# Altium schematic sheet USB-Port.SchDoc: External USB Port
size A4; Revision: 1.0
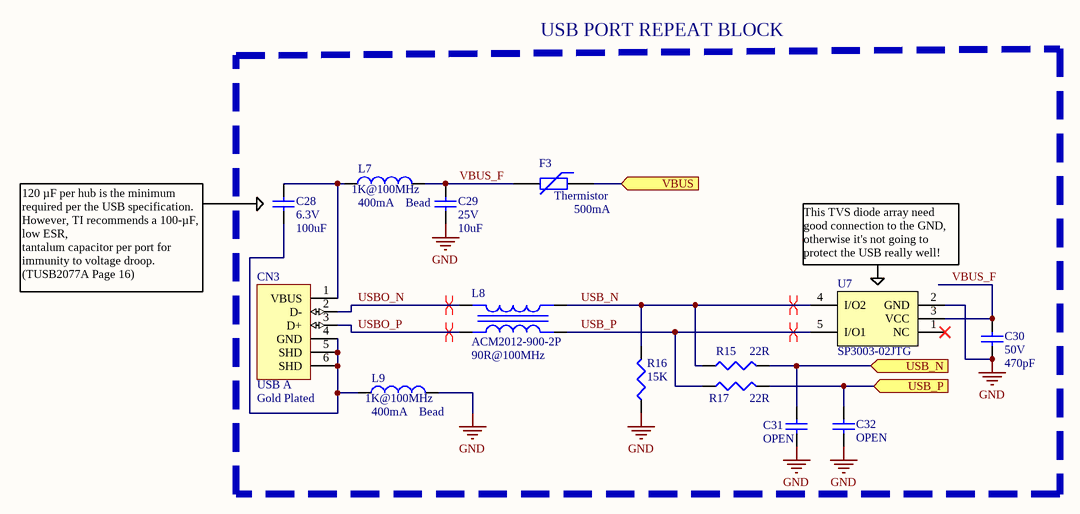
[diagram p0: USB-Port.SchDoc]

## Parts
C28  value 100uF  Tensão: 6.3V  [CC1206]  (hidden comment: Capacitor Cerâmico)
C29  value 10uF  Tensão: 25V  [CC0805]  (hidden comment: Capacitor Cerâmico)
C30  value 470pF  Tensão: 50V  [CC0603]  (hidden comment: Capacitor Cerâmico)
C31  value OPEN  [CC0603]  (hidden comment: Capacitor Cerâmico)  (no BOM)
C32  value OPEN  [CC0603]  (hidden comment: Capacitor Cerâmico)  (no BOM)
CN3  USB A  value Gold Plated  [CONN_USB-A_RCPT-V - AMP FCI]
F3  Thermistor  Corrente: 500mA  [CC1812]
L7  Bead  value 1K@100MHz  Corrente: 400mA  [CC0603]
L8  ACM2012-900-2P  value 90R@100MHz  [TR0805-4N]
L9  Bead  value 1K@100MHz  Corrente: 400mA  [CC0603]
R15  value 22R  [CC0603]  (hidden comment: Resistor)
R16  value 15K  [CC0603]  (hidden comment: Resistor)
R17  value 22R  [CC0603]  (hidden comment: Resistor)
U7  SP3003-02JTG  [SC70-5N]

## Blocks framed on the sheet
USB PORT REPEAT BLOCK: C28-C32 CN3 F3 L7-L9 R15-R17 U7

## Ports
USB_N (in), USB_P (in), VBUS (in)

## Nets
GND: C29.1 C30.1 C31.1 C32.1 L9.2 R16.1 U7.2(GND)
USB_N: L8.2(Pri-) R15.1 R16.2 U7.4(I/O2)
USB_N: C31.2 R15.2 ; port USB_N  [a separate net that carries the same name]
USB_P: L8.1(Pri+) R17.1 U7.5(I/O1)
USB_P: C32.2 R17.2 ; port USB_P  [a separate net that carries the same name]
USBO_N: CN3.2(D-) L8.3(Sec+)
USBO_P: CN3.3(D+) L8.4(Sec-)
VBUS: F3.1 ; port VBUS
VBUS_F: C29.2 C30.2 F3.2 L7.2 U7.3(VCC)
NetC28_1: C28.1 CN3.4(GND) CN3.5(SHD) CN3.6(SHD) L9.1
NetC28_2: C28.2 CN3.1(VBUS) L7.1

Not connected (* = marked no-connect by the designer): U7 1(NC)*

## Layout directives
differential pair: USB_N, USB_P, USBO_N, USBO_P

## Notes on the sheet
- 120 µF per hub is the minimum required per the USB specification. However, TI recommends a 100-µF, low ESR,
  tantalum capacitor per port for immunity to voltage droop. (TUSB2077A Page 16)
- (near U7) This TVS diode array need good connection to the GND, otherwise it's not going to protect the USB really well!
- Projeto:
- Tamanho:
- Data:
- A4
- Eng. Felipe Navarro
- Hora:
- Revisão:
- Folha
- de
- Arquivo:

## Library data of the parts
C28 = Cap 100uF 6.3V 1206 X5R: Capacitor (Semiconductor SIM Model); Chinês: -----; ChinesePrice: 0,00000; Corrente: *A; Potência: *W; Obs:: X5R; Tolerância: ±20%; Supplier 1: Digi-Key; Supplier Part Number 1: 490-7217-1-ND; ComponentLink1Description: Datasheet; ComponentLink1URL: D:\Tecnoclade\Datasheet\!DataMissing.pdf
C29 = Cap 10uF 25V 0805 X5R: Capacitor (Semiconductor SIM Model); Chinês: Local; ChinesePrice: 0,02620; Corrente: *A; Potência: *W; Obs:: X5R; Tolerância: ±10%; Supplier 1: Digi-Key; Supplier Part Number 1: 587-2985-1-ND; ComponentLink1Description: Datasheet; ComponentLink1URL: D:\Tecnoclade\Datasheet\!DataMissing.pdf
C30 = Cap 470pF 50V 0603 X7R: Capacitor (Semiconductor SIM Model); Chinês: Local; ChinesePrice: 0,00180; Corrente: *A; Potência: *W; Obs:: X7R; Tolerância: ±10%; Supplier 1: Digi-Key; Supplier Part Number 1: 399-1075-1-ND; ComponentLink1Description: Datasheet; ComponentLink1URL: D:\Tecnoclade\Datasheet\!DataMissing.pdf
C31 C32 = Cap OPEN 0603: Capacitor (Semiconductor SIM Model); Chinês: -----; ChinesePrice: 0,00000; Corrente: *A; Potência: *W; Tolerância: ±*%; Tensão: *V; Supplier 1: Digi-Key; Supplier Part Number 1: --Del; Obs:: *; ComponentLink1Description: Datasheet; ComponentLink1URL: D:\Tecnoclade\Datasheet\!DataMissing.pdf
CN3 = USB A RCPT-H: Conector Jack USB A, Through Hole, Horizontal; ChinesePrice: 0,00000; Chinês: ----; Corrente: *; Potência: *; Supplier 1: Digi-Key; Supplier Part Number 1: 609-1041-ND; Tensão: *; Tolerância: *; ComponentLink1Description: Datasheet
F3 = Res Varistor: Varistor (Voltage-Sensitive Resistor); Tensão: 15V; ChinesePrice: 0,09500; Chinês: Local; Obs: TRIP: 1A; Supplier 1: Digi-Key; Supplier Part Number 1: 507-1762-1-ND; ComponentLink1Description: Datasheet; ComponentLink1URL: D:\Tecnoclade\Datasheet\!DataMissing.pdf
L7 L9 = Bd 1K@100MHz 0603 400mA: ChinesePrice: 0,00000; Chinês: -----; Obs:: Ferrite (0R5); Tolerância: ±25%; Potência: *; Supplier 1: Digi-Key; Supplier Part Number 1: 445-1550-1-ND; Tensão: *; ComponentLink1Description: Datasheet; ComponentLink1URL: D:\Tecnoclade\Datasheet\!DataMissing.pdf; Substituição: 27/06/2014
L8 = ACM2012-900-2P: Indutor de Modo Comum; Corrente: 400mA; ChinesePrice: 0,19100; Chinês: Local; Potência: *W; Tensão: *V; Tolerância: ±*%; Obs:: Z=0R19; Supplier Part Number 1: 445-2207-1-ND; Supplier 1: Digi-Key; ComponentLink1Description: Datasheet; ComponentLink1URL: D:\Tecnoclade\Datasheet\!DataMissing.pdf; Substituição: 00/00/0000
R15 R17 = Res 22R 1% 0603 1/10W: ChinesePrice: 0,00000; Chinês: ----; Corrente: *A; Potência: 1/10W; Tensão: *V; Obs: ±100ppm/ºC; Tolerância: ±1%; Supplier 1: Digi-Key; Supplier Part Number 1: RMCF0603FT22R0CT-ND; ComponentLink1Description: Datasheet; ComponentLink1URL: D:\Tecnoclade\Datasheet\!DataMissing.pdf
R16 = Res 15K 1% 0603 1/10W: ChinesePrice: 0,00000; Chinês: -----; Corrente: *A; Potência: 1/10W; Tensão: *V; Obs: ±100ppm/ºC; Tolerância: ±1%; Supplier 1: Digi-Key; Supplier Part Number 1: RMCF0603FT15K0CT-ND; ComponentLink1Description: Datasheet; ComponentLink1URL: D:\Tecnoclade\Datasheet\!DataMissing.pdf
U7 = SP3003-02JTG: TVS DIODE ARRAY; Value: 0.65pF; Tensão: 6V; Supplier Part Number 1: F3301CT-ND; Supplier 1: Digi-Key